# Altium schematic sheet Conn.SchDoc: Test
size A4; DrawnBy: Łukasz Przeniosło; Organization: Zachodniopomorski; Address1: Uniwersytet Technologiczny; Address2: w Szczecinie; Address3: Wydział Elektryczny; DocumentNumber: 1111; Revision: 1.0; SheetNumber: 0; SheetTotal: 0
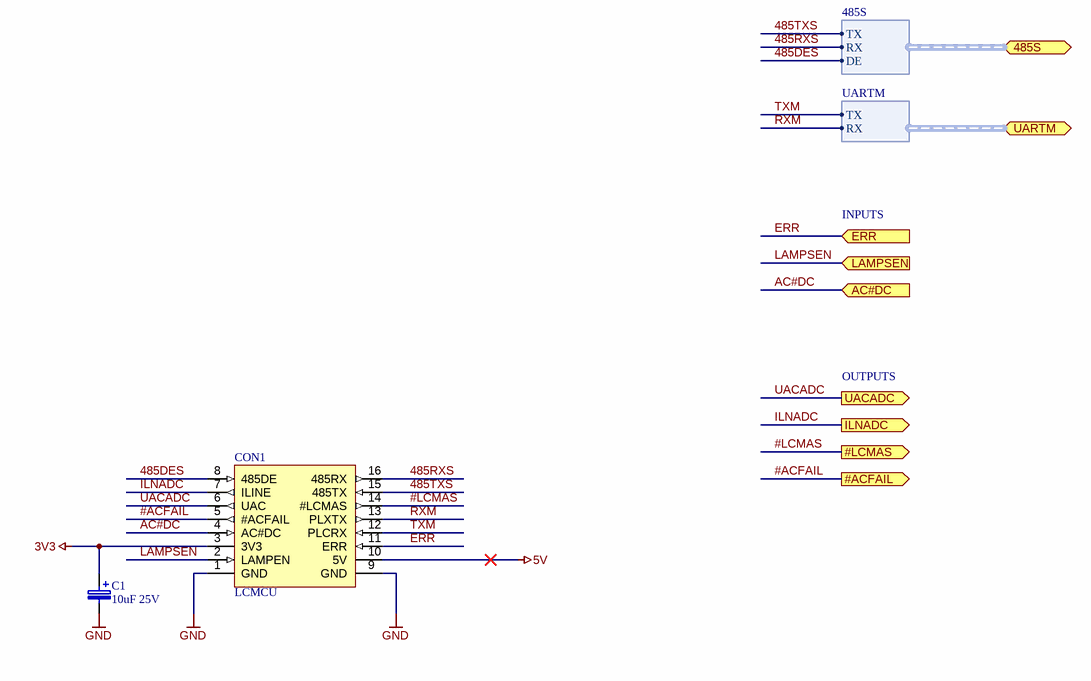
[diagram p0: Conn.SchDoc]

## Parts
C1  10uF 25V  [SMDB]
CON1  LCMCU  [IDC_FEM_BOT_16]

## Ports
485S (harness 485S), #ACFAIL (out), #LCMAS (out), AC#DC (in), ERR (in), ILNADC (out), LAMPSEN (in), UACADC (out), UARTM (harness UARTM)

## Harnesses
485S: TX, RX, DE
UARTM: TX, RX

## Nets
3V3: C1.1 CON1.3(3V3)
5V: CON1.10(5V)
GND: C1.2 CON1.1(GND) CON1.9(GND)
485DES: CON1.8(485DE) ; port 485S.DE
485RXS: CON1.16(485RX) ; port 485S.RX
485TXS: CON1.15(485TX) ; port 485S.TX
#ACFAIL: CON1.5(#ACFAIL) ; port #ACFAIL
#LCMAS: CON1.14(#LCMAS) ; port #LCMAS
AC#DC: CON1.4(AC#DC) ; port AC#DC
ERR: CON1.11(ERR) ; port ERR
ILNADC: CON1.7(ILINE) ; port ILNADC
LAMPSEN: CON1.2(LAMPEN) ; port LAMPSEN
RXM: CON1.13(PLXTX) ; port UARTM.RX
TXM: CON1.12(PLCRX) ; port UARTM.TX
UACADC: CON1.6(UAC) ; port UACADC

## Notes on the sheet
- INPUTS
- OUTPUTS
- Title
- Size:
- Date:
- A4
- Author:
- Time:
- Sheet
- of
- File:

## Library data of the parts
C1 = Capacitor Tantalum: Value: 10uF 25V